# EAGLE design OSO-MISC-22-006 LCD Wing (EAGLE 9.6.2)
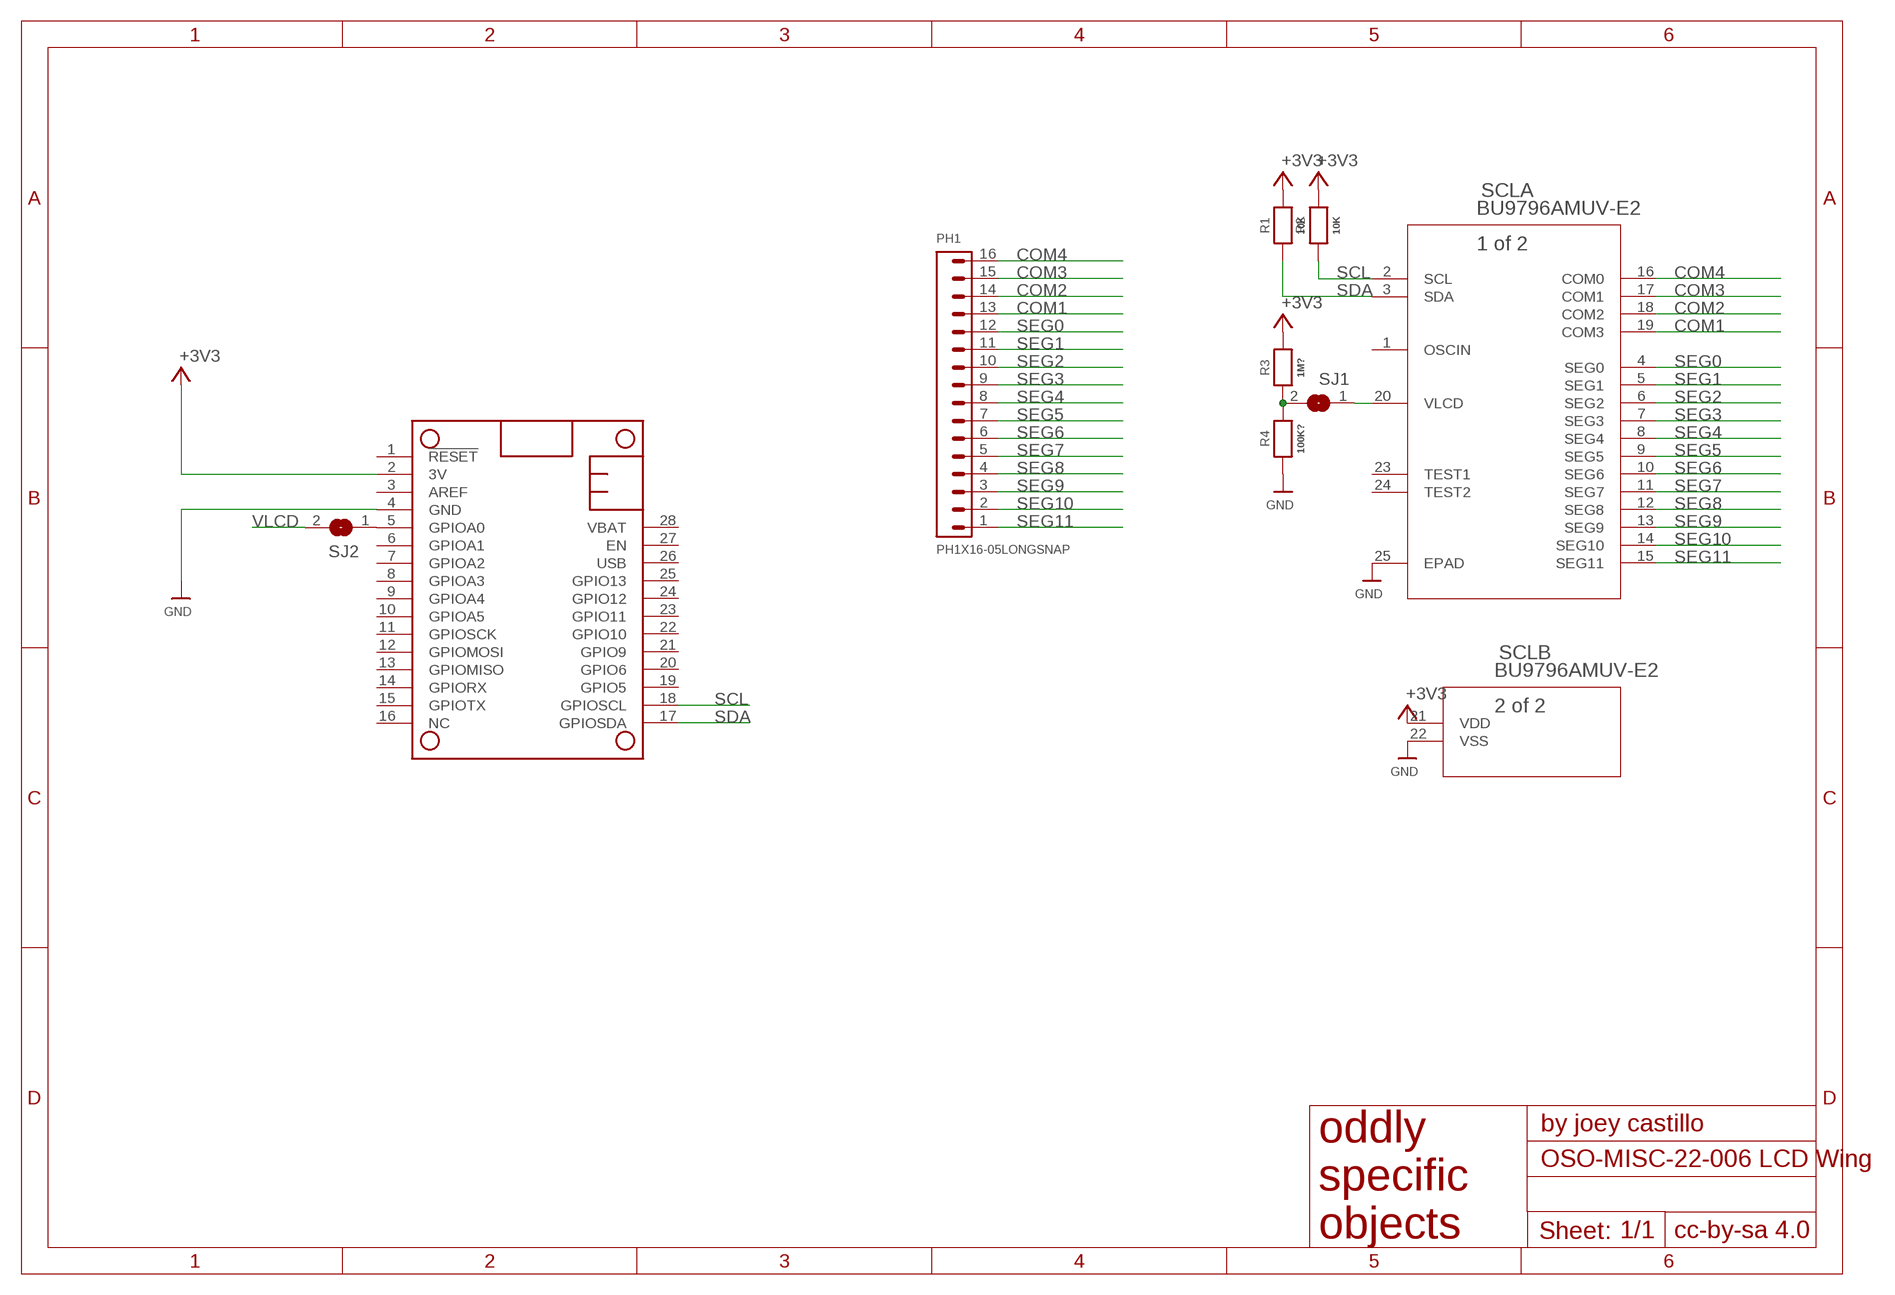
[diagram p0: schematic, sheet 1]

## Parts
MS1  FEATHERWING  [FEATHERWING]
PH1  PH1X16-05LONGSNAP  [PHLS005-1-16]
R1  10K  RESISTOR_0805MP  [_0805MP]
R2  10K  RESISTOR_0805MP  [_0805MP]
R3  1M?  RESISTOR_0805MP  [_0805MP]
R4  100K?  RESISTOR_0805MP  [_0805MP]
SCL  BU9796AMUV-E2  [VQFN024V4040_ROM]
SJ1  SOLDERJUMPERCLOSED  [SOLDERJUMPER_CLOSEDWIRE]
SJ2  SOLDERJUMPER  [SOLDERJUMPER_ARROW_NOPASTE]

## Nets
+3V3: MS1.2(3V) R1.1 R2.1 R3.1 SCL.21(B:VDD)
A0: MS1.5(GPIOA0) SJ2.1
COM1: PH1.13 SCL.19(A:COM3)
COM2: PH1.14 SCL.18(A:COM2)
COM3: PH1.15 SCL.17(A:COM1)
COM4: PH1.16 SCL.16(A:COM0)
GND: MS1.4(GND) R4.2 SCL.22(B:VSS) SCL.25(A:EPAD)
N$4: R3.2 R4.1 SJ1.2
SCL: MS1.18(GPIOSCL) R2.2 SCL.2(A:SCL)
SDA: MS1.17(GPIOSDA) R1.2 SCL.3(A:SDA)
SEG0: PH1.12 SCL.4(A:SEG0)
SEG1: PH1.11 SCL.5(A:SEG1)
SEG2: PH1.10 SCL.6(A:SEG2)
SEG3: PH1.9 SCL.7(A:SEG3)
SEG4: PH1.8 SCL.8(A:SEG4)
SEG5: PH1.7 SCL.9(A:SEG5)
SEG6: PH1.6 SCL.10(A:SEG6)
SEG7: PH1.5 SCL.11(A:SEG7)
SEG8: PH1.4 SCL.12(A:SEG8)
SEG9: PH1.3 SCL.13(A:SEG9)
SEG10: PH1.2 SCL.14(A:SEG10)
SEG11: PH1.1 SCL.15(A:SEG11)
VLCD: SCL.20(A:VLCD) SJ1.1 SJ2.2
Unconnected: MS1.1(!RESET) MS1.3(AREF) MS1.6(GPIOA1) MS1.7(GPIOA2) MS1.8(GPIOA3) MS1.9(GPIOA4) MS1.10(GPIOA5) MS1.11(GPIOSCK) MS1.12(GPIOMOSI) MS1.13(GPIOMISO) MS1.14(GPIORX) MS1.15(GPIOTX) MS1.16(NC) MS1.19(GPIO5) MS1.20(GPIO6) MS1.21(GPIO9) MS1.22(GPIO10) MS1.23(GPIO11) MS1.24(GPIO12) MS1.25(GPIO13) MS1.26(USB) MS1.27(EN) MS1.28(VBAT) SCL.1(A:OSCIN) SCL.23(A:TEST1) SCL.24(A:TEST2)

## Library data of the parts
MS1 = microbuilder:FEATHERWING
PH1 = pel_hdr:PH1X16
R1-R4 = microbuilder:RESISTOR: Resistors For new designs, use the packages preceded by an '_' character since they are more reliable: The following footprints should be used on most boards: _0402 - Standard footprint for regular board layouts _0603 - Standard footprint for regular board layouts _0805 - Standard footprint for regular board layouts _1206 - Standard footprint for regular board layouts For extremely tight-pitch boards where space is at a premium, the following 'micro-pitch' footprints can be used (smaller pads, no silkscreen outline, etc.): _0402MP - Micro-pitch footprint for very dense/compact boards _0603MP - Micro-pitch footprint for very dense/compact boards _0805MP - Micro-pitch footprint for very dense/compact boards _1206MP - Micro-pitch footprint for very dense/compact boards
SCL = BU9796AMUV:BU9796AMUV-E2; COPYRIGHT: Copyright (C) 2022 Ultra Librarian. All rights reserved.; DIGI-KEY_PART_NUMBER_1: BU9796AMUV-E2TR-ND; DIGI-KEY_PART_NUMBER_2: BU9796AMUV-E2CT-ND; DIGI-KEY_PART_NUMBER_3: BU9796AMUV-E2DKR-ND; MANUFACTURER_PART_NUMBER: BU9796AMUV-E2; MFR_NAME: ROHM Semiconductor
SJ1 = microbuilder:SOLDERJUMPER: SMD Solder JUMPER Solder the two pads together to create a connection, or remove the solder to break it. REFLOW - Use this footprint for solder paste and reflow ovens. WAVE - Use this footprint for hand-soldering (larger pads). CLOSED - Has a trace between the two pads to ensure it is closed by default. The trace needs to be cut to disable the jumper, and can be closed again by creating a solder bridge between the two pads.
SJ2 = microbuilder:SOLDERJUMPER: SMD Solder JUMPER Solder the two pads together to create a connection, or remove the solder to break it. REFLOW - Use this footprint for solder paste and reflow ovens. WAVE - Use this footprint for hand-soldering (larger pads). CLOSED - Has a trace between the two pads to ensure it is closed by default. The trace needs to be cut to disable the jumper, and can be closed again by creating a solder bridge between the two pads.; BOM: EXCLUDE

## Net classes
1 power: width 0.305 mm, drill 0.305 mm
2 gnd: width 0.254 mm, drill 0.254 mm

## Board
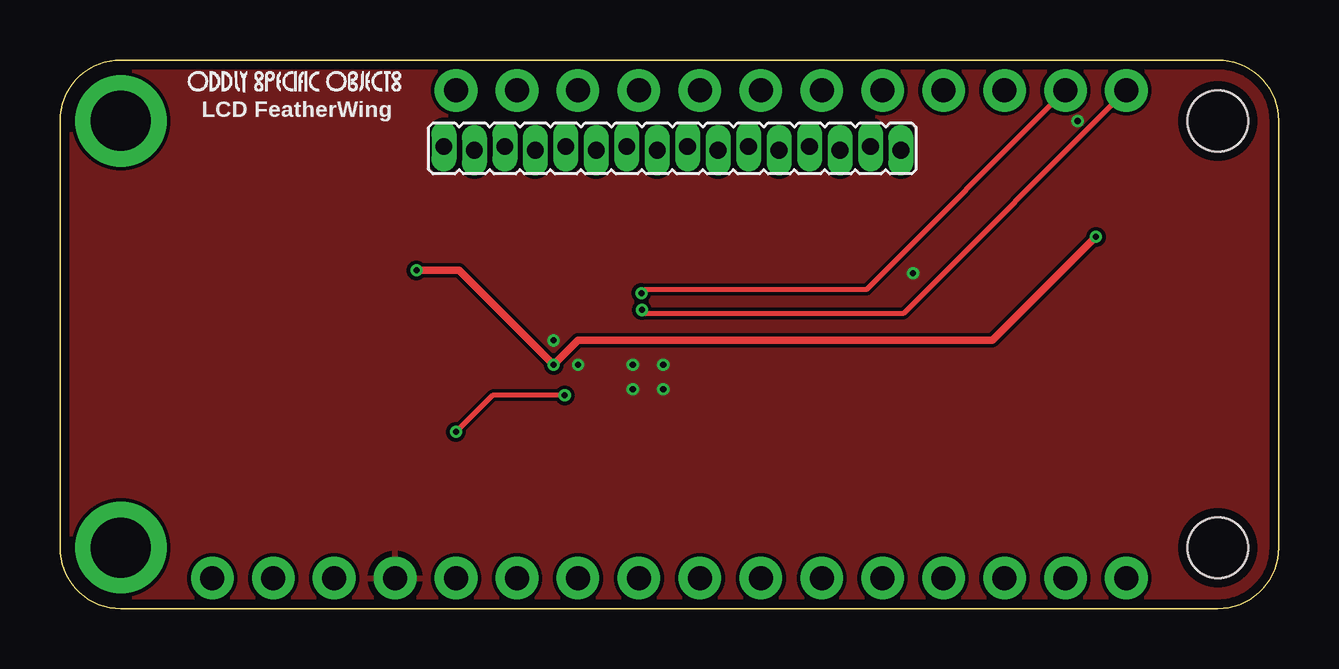
[diagram p1: board, top side]
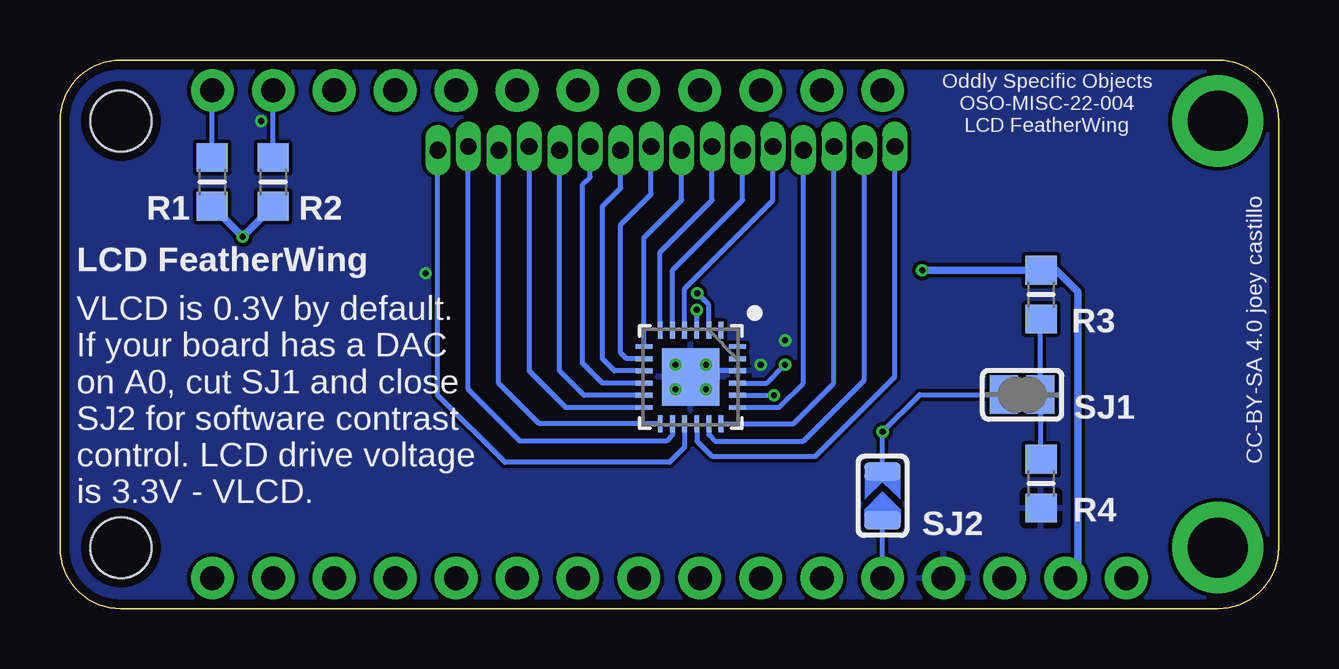
[diagram p2: board, bottom side, seen from below]

Size 50.8 x 22.86 mm. Coordinates in mm from the lower left corner, seen from the top.
Outline: 2.54,22.86 48.26,22.86 arc-90 50.8,20.32 50.8,2.54 arc-90 48.26,0 2.54,0 arc-90 0,2.54 0,20.32 arc-90 2.54,22.86
Copper layers (1*16): Top 0.035559375mm / dielectric 1.6mm / Bottom 0.035559375mm
Design rules "oshpark-2layer *": minimum track width 6mil, minimum drill 10mil, track to track 6mil, track to pad 6mil, pad to pad 6mil, via to via 6mil, smd to smd 6mil, copper to edge 15mil, drill to drill 6mil, minimum pad ring 5mil, minimum via ring 5mil, stop-mask expansion 2.5mil, vias tented up to drill 12mil, thermal gap 10mil

### Footprints (pad centres in the part's own frame; a part is rotated, then mirrored left to right if it is on the bottom)
FEATHERWING = drill 1 pad 1.778: 1 6.35,1.27; 2 8.89,1.27; 3 11.43,1.27; 4 13.97,1.27; 5 16.51,1.27; 6 19.05,1.27; 7 21.59,1.27; 8 24.13,1.27; 9 26.67,1.27; 10 29.21,1.27; 11 31.75,1.27; 12 34.29,1.27; 13 36.83,1.27; 14 39.37,1.27; 15 41.91,1.27; 16 44.45,1.27; 17 44.45,21.59; 18 41.91,21.59; 19 39.37,21.59; 20 36.83,21.59; 21 34.29,21.59; 22 31.75,21.59; 23 29.21,21.59; 24 26.67,21.59; 25 24.13,21.59; 26 21.59,21.59; 27 19.05,21.59; 28 16.51,21.59 | drill 2.5 pad 3.81: P$1 2.54,20.32; P$2 2.54,2.54 | hole 2.54: 48.26,20.32; 48.26,2.54
PHLS005-1-16 = drill 0.7 pad 1.016 long: 1 0,0.076; 2 1.27,-0.076; 3 2.54,0.076; 4 3.81,-0.076; 5 5.08,0.076; 6 6.35,-0.076; 7 7.62,0.076; 8 8.89,-0.076; 9 10.16,0.076; 10 11.43,-0.076; 11 12.7,0.076; 12 13.97,-0.076; 13 15.24,0.076; 14 16.51,-0.076; 15 17.78,0.076; 16 19.05,-0.076
_0805MP = smd 1.2 x 1.3: 1 -1.016,0; 2 1.016,0
VQFN024V4040_ROM = smd 0.711 x 0.203: 1 -1.943,1.27; 2 -1.943,0.762; 3 -1.943,0.254; 4 -1.943,-0.254; 5 -1.943,-0.762; 6 -1.943,-1.27; 13 1.943,-1.27; 14 1.943,-0.762; 15 1.943,-0.254; 16 1.943,0.254; 17 1.943,0.762; 18 1.943,1.27 | smd 0.203 x 0.711: 7 -1.27,-1.943; 8 -0.762,-1.943; 9 -0.254,-1.943; 10 0.254,-1.943; 11 0.762,-1.943; 12 1.27,-1.943; 19 1.27,1.943; 20 0.762,1.943; 21 0.254,1.943; 22 -0.254,1.943; 23 -0.762,1.943; 24 -1.27,1.943 | smd 2.388 x 2.388: 25 0,0
SOLDERJUMPER_CLOSEDWIRE = smd 1.168 x 1.6: 1 -0.762,0; 2 0.762,0 | smd 0.635 x 0.203: WIRE 0,0
SOLDERJUMPER_ARROW_NOPASTE = smd 0.762 x 1.524: 1 -1.016,0; 2 1.016,0

### Placement (x,y rotation side)
MS1  0,0 0 top
PH1  35.05,19.18 180 top
R1  44.45,17.78 90 bottom
R2  41.91,17.78 90 bottom
R3  9.91,13.08 270 bottom
R4  9.91,5.21 270 bottom
SCL  24.51,9.65 270 bottom
SJ1  10.69,8.92 0 bottom
SJ2  16.51,4.7 90 bottom
U$2  [OSO_WORDMARK_ONELINE_350MIL_1000DPI]  9.78,21.97 0 top

### Tracks (layer width: path | path; a pad name or v marks a point on that pad's centre or on a via)
+3V3  (via drill 0.25)
  Top 0.305: v14.86,14.1 16.64,14.1 v20.57,10.16 21.59,11.18 38.86,11.18 v43.18,15.49
  Bottom 0.203: SCL.21 21.34,9.4 v20.57,10.16
  Bottom 0.305: MS1.2 8.38,1.78 8.38,13.21 9.27,14.1 R3.1 v14.86,14.1 | R1.1 v43.18,15.49 R2.1
A0
  Bottom 0.203: MS1.5 SJ2.1
COM1
  Bottom 0.203: SCL.19 20.83,8.38 19.81,9.4 PH1.13
COM2
  Bottom 0.203: PH1.14 18.54,9.4 20.23,7.71 SCL.18
COM3
  Bottom 0.203: SCL.17 23.75,7.24 23.5,6.99 19.81,6.99 17.27,9.53 PH1.15
COM4
  Bottom 0.203: SCL.16 24.26,6.99 23.62,6.35 19.3,6.35 16,9.65 PH1.16
GND  (via drill 0.25)
  Bottom 0.203: SCL.22 23.62,9.91 v23.88,10.16 24.38,9.65 SCL.25
  other vias: 25.15,10.16 25.15,9.14 23.88,9.14 42.42,20.32 35.56,13.97 21.59,10.16 20.57,11.18
  pour Bottom: -1.02,23.88 51.05,23.88 51.56,23.37 52.07,22.86 52.07,-0.51 51.31,-1.27 0,-1.27 -1.27,0 -1.27,23.62
  pour Top: -1.02,24.64 -2.03,24.64 -3.05,23.62 -3.05,0.51 0,-2.54 48.51,-2.54 53.09,2.03 53.09,24.38 52.83,24.64
N$4
  Bottom 0.203: R4.1 9.91,8.89 SJ1.2 9.93,12.04 R3.2
SCL  (via drill 0.25)
  Top 0.203: MS1.18 33.62,13.3 24.39,13.3 v24.24,13.14
  Bottom 0.203: SCL.2 23.75,12.66 v24.24,13.14 | R2.2 MS1.18
SDA  (via drill 0.25)
  Top 0.203: MS1.17 35.15,12.29 24.41,12.29 v24.26,12.45
  Bottom 0.203: SCL.3 v24.26,12.45 | R1.2 MS1.17
SEG0
  Bottom 0.203: SCL.4 24.77,13.34 21.08,17.02 PH1.12
SEG1
  Bottom 0.203: SCL.5 25.27,14.1 22.35,17.02 PH1.11
SEG2
  Bottom 0.203: SCL.6 25.78,14.86 23.62,17.02 PH1.10
SEG3
  Bottom 0.203: SCL.7 26.45,15.46 24.89,17.02 PH1.9
SEG4
  Bottom 0.203: SCL.8 27.18,10.41 27.43,10.67 27.43,16 26.16,17.27 PH1.8
SEG5
  Bottom 0.203: SCL.9 27.69,9.91 28.19,10.41 28.19,16.76 27.43,17.53 PH1.7
SEG6
  Bottom 0.203: SCL.10 28.19,9.4 29.03,10.24 29.03,17.65 28.7,17.98 PH1.6
SEG7
  Bottom 0.203: SCL.11 28.96,8.89 29.97,9.91 PH1.5
SEG8
  Bottom 0.203: PH1.4 31.24,9.91 29.72,8.38 SCL.12
SEG9
  Bottom 0.203: SCL.13 30.82,7.71 32.51,9.4 PH1.3
SEG10
  Bottom 0.203: SCL.14 25.27,7.24 25.53,6.99 31.62,6.99 33.78,9.14 PH1.2
SEG11
  Bottom 0.203: SCL.15 24.77,6.73 25.4,6.1 32.26,6.1 35.05,8.89 PH1.1
VLCD  (via drill 0.25)
  Top 0.203: v21.04,8.89 18.03,8.89 v16.51,7.37
  Bottom 0.203: SCL.20 v21.04,8.89 | SJ1.1 14.96,8.91 v16.51,7.37 SJ2.2

### Text on the board
tPlace: LCD FeatherWing
bPlace: Oddly Specific Objects / OSO-MISC-22-004 / LCD FeatherWing | LCD FeatherWing | VLCD is 0.3V by default. / If your board has a DAC / on A0, cut SJ1 and close / SJ2 for software contrast / control. LCD drive voltage / is 3.3V - VLCD. | CC-BY-SA 4.0 joey castillo